# EAGLE design TPA6120_Test_V1 (EAGLE 6.4)
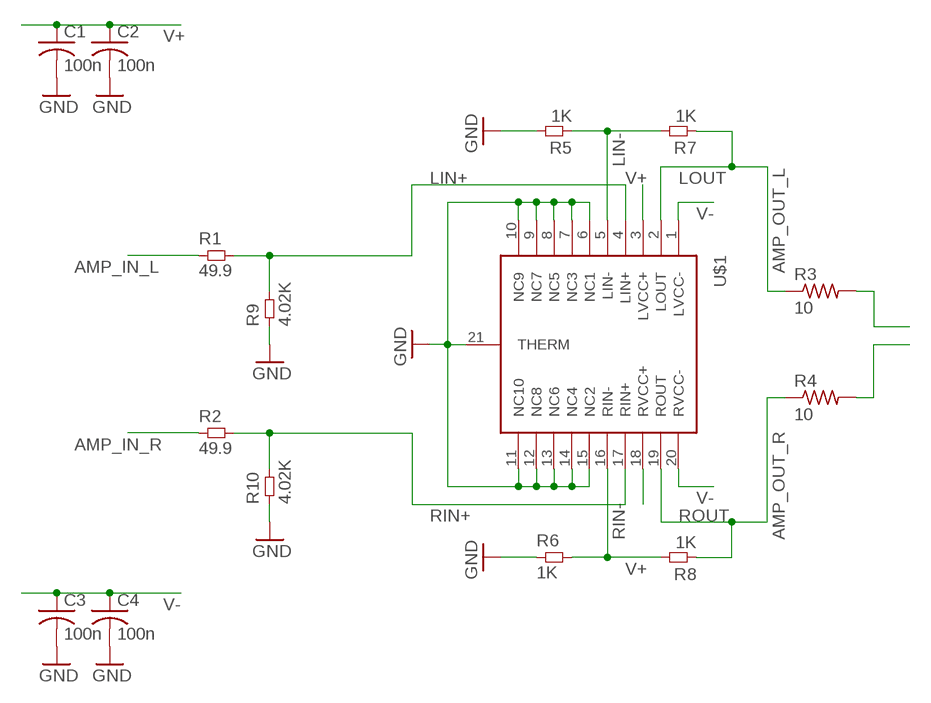
[diagram p0: schematic, sheet 1]

## Parts
C1  100n  C-USC0603  [C0603]
C2  100n  C-USC0603  [C0603]
C3  100n  C-USC0603  [C0603]
C4  100n  C-USC0603  [C0603]
R1  49.9  RES0603L3  [0603L3]
R2  49.9  RES0603L3  [0603L3]
R3  10  R-US_R1206  [R1206]
R4  10  R-US_R1206  [R1206]
R5  1K  RES0603L3  [0603L3]
R6  1K  RES0603L3  [0603L3]
R7  1K  RES0603L3  [0603L3]
R8  1K  RES0603L3  [0603L3]
R9  4.02K  RES0603L3  [0603L3]
R10  4.02K  RES0603L3  [0603L3]
U$1  TPA6120_TPA6120  [TPA6120_TPA6120]

## Nets
AMP_IN_L: R1.P$1
AMP_IN_R: R2.P$1
AMP_OUT_L: R3.2
AMP_OUT_R: R4.2
GND: C1.2 C2.2 C3.2 C4.2 R5.P$2 R6.P$1 R9.P$1 R10.P$1 U$1.6(NC1) U$1.7(NC3) U$1.8(NC5) U$1.9(NC7) U$1.10(NC9) U$1.11(NC10) U$1.12(NC8) U$1.13(NC6) U$1.14(NC4) U$1.15(NC2) U$1.21(THERM)
LIN+: R1.P$2 R9.P$2 U$1.4(LIN+)
LIN-: R5.P$1 R7.P$2 U$1.5(LIN-)
LOUT: R3.1 R7.P$1 U$1.2(LOUT)
RIN+: R2.P$2 R10.P$2 U$1.17(RIN+)
RIN-: R6.P$2 R8.P$2 U$1.16(RIN-)
ROUT: R4.1 R8.P$1 U$1.19(ROUT)
V+: C1.1 C2.1 U$1.3(LVCC+) U$1.18(RVCC+)
V-: C3.1 C4.1 U$1.1(LVCC-) U$1.20(RVCC-)

## Library data of the parts
C1-C4 = rcl:C-US: CAPACITOR, American symbol
R1 R2 R5-R10 = common:RES
R3 R4 = rcl:R-US_: RESISTOR, American symbol
U$1 = amp:TPA6120_TPA6120

## Board
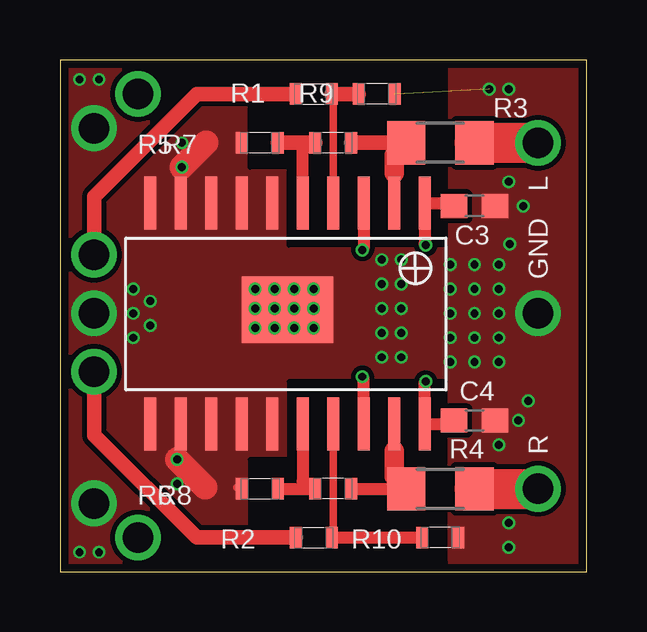
[diagram p1: board, top side]
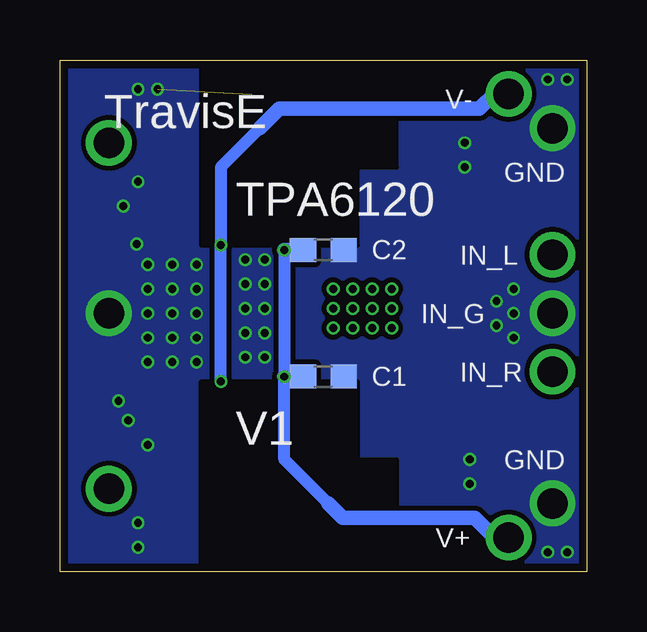
[diagram p2: board, bottom side, seen from below]

Size 21.95 x 21.34 mm. Coordinates in mm from the lower left corner, seen from the top.
Outline: 0,0 21.95,0 21.95,21.34 0,21.34 0,0
Copper layers (1*16): Top 0.035mm / dielectric 1.5mm / Bottom 0.035mm
Design rules "default *": minimum track width 10mil, minimum drill 24mil, track to track 8mil, track to pad 8mil, pad to pad 8mil, via to via 8mil, smd to smd 8mil, copper to edge 13mil, drill to drill 8mil, minimum pad ring 5mil, minimum via ring 4mil, stop-mask expansion 4mil, vias tented up to drill 14mil, thermal gap 10mil
tRestrict: area 7.9,0.4 to 16.1,7.9; area 7.9,13.6 to 16.1,20.9
bRestrict: area 7.9,0.4 to 16.1,7.9; area 7.9,13.6 to 16.1,20.9

### Footprints (pad centres in the part's own frame; a part is rotated, then mirrored left to right if it is on the bottom)
C0603 = smd 1.1 x 1: 1 -0.85,0; 2 0.85,0
0603L3 = smd 0.5 x 0.9: P$1 -0.75,0; P$2 0.75,0
R1206 = smd 1.6 x 1.803: 1 -1.422,0; 2 1.422,0
TPA6120_TPA6120 = smd 0.5 x 2.2: 1 0.25,1.095; 2 1.52,1.095; 3 2.79,1.095; 4 4.06,1.095; 5 5.33,1.095; 6 6.6,1.095; 7 7.87,1.095; 8 9.14,1.095; 9 10.41,1.095; 10 11.68,1.095; 11 11.68,10.295; 12 10.41,10.295; 13 9.14,10.295; 14 7.87,10.295; 15 6.6,10.295; 16 5.33,10.295; 17 4.06,10.295; 18 2.79,10.295; 19 1.52,10.295; 20 0.25,10.295 | smd 3.81 x 2.79: 21 5.965,5.54

### Placement (x,y rotation side)
C1  10.97,8.13 0 bottom
C2  10.97,13.41 0 bottom
C3  17.27,15.24 0 top
C4  17.27,6.3 0 top
R1  10.57,19.91 0 top
R2  10.57,1.42 0 top
R3  15.85,17.88 0 top
R4  15.85,3.45 0 top
R5  8.33,17.88 180 top
R6  8.33,3.45 0 top
R7  11.38,17.88 180 top
R8  11.38,3.45 180 top
R9  13.21,19.91 180 top
R10  15.85,1.42 180 top
U$1  15.44,16.46 180 top

### Tracks (layer width: path | path; a pad name or v marks a point on that pad's centre or on a via)
AMP_IN_L  (via drill 1.27)
  Top 0.61: v1.42,13.21 1.42,15.65 5.69,19.91 R1.P$1
AMP_IN_R  (via drill 1.27)
  Top 0.61: v1.42,8.33 1.42,5.69 5.69,1.42 R2.P$1
AMP_OUT_L  (via drill 1.27)
  Top 1.676: R3.2 v19.91,17.88
AMP_OUT_R  (via drill 1.27)
  Top 1.676: R4.2 v19.91,3.45
GND  (via drill 0.33, 1.27)  (1 unrouted)
  Top 0.305: 7.42,3.45 7.37,3.51
  Top 1.016: 6.04,3.51 v4.88,4.67 | 6.1,17.88 v5.08,16.87
  other vias: 1.42,10.77 0.81,20.52 1.63,20.52 0.81,0.81 1.63,0.81 5.08,17.88 3.05,11.79 3.76,11.28 3.05,10.77 3.76,10.26 3.05,9.75 4.88,3.66 1.42,2.84 1.42,18.49 13.41,13 14.22,13 13.41,11.99 13.41,10.97 13.41,9.96 13.41,8.94 14.22,11.99 14.22,10.97 14.22,9.96 14.22,8.94 16.26,12.8 16.26,11.79 16.26,10.77 16.26,9.75 16.26,8.74 17.27,12.8 17.27,11.79 17.27,10.77 17.27,9.75 17.27,8.74 18.29,12.8 18.29,11.79 18.29,10.77 18.29,9.75 18.29,8.74 18.75,13.67 19.3,15.24 18.69,16.26 18.69,20.12 17.88,20.12 18.69,2.03 18.69,1.02 19.51,7.11 19.1,6.3 18.29,5.28 19.91,10.77
  pour Bottom (no thermals): 0.41,20.93 21.54,20.93 21.54,0.41 0.41,0.41
  pour Top (no thermals): 0.41,20.93 21.54,20.93 21.54,0.41 0.41,0.41
LIN+
  Top 0.305: U$1.4 11.38,19.85 R1.P$2
  Top 0.61: R1.P$2 R9.P$2
LIN-
  Top 0.508: U$1.5 10.11,17.57 R7.P$2
  Top 0.61: R5.P$1 R7.P$2
LOUT
  Top 0.483: U$1.2 13.92,16.61
  Top 0.61: R7.P$1 R3.1
  Top 0.813: 13.92,16.61 13.92,17.37 R3.1
N$1  (via drill 0.33)
  other vias: 8.13,11.79
N$2  (via drill 0.33)
  other vias: 8.13,10.97
N$7  (via drill 0.33)
  other vias: 8.13,10.16
N$8  (via drill 0.33)
  other vias: 8.94,11.79
N$9  (via drill 0.33)
  other vias: 8.94,10.97
N$10  (via drill 0.33)
  other vias: 8.94,10.16
N$11  (via drill 0.33)
  other vias: 9.75,11.79
N$12  (via drill 0.33)
  other vias: 9.75,10.97
N$13  (via drill 0.33)
  other vias: 9.75,10.16
N$14  (via drill 0.33)
  other vias: 10.57,11.79
N$15  (via drill 0.33)
  other vias: 10.57,10.97
N$16  (via drill 0.33)
  other vias: 10.57,10.16
RIN+
  Top 0.305: U$1.17 11.38,1.49 R2.P$2
  Top 0.508: R2.P$2 R10.P$2
RIN-
  Top 0.508: R6.P$2 R8.P$2 10.11,3.77 U$1.16
ROUT
  Top 0.483: U$1.19 13.92,5.03
  Top 0.508: R8.P$1 R4.1
  Top 0.813: 13.92,5.03 13.92,3.96 R4.1
V+  (via drill 0.33, 1.27)
  Top 0.508: U$1.3 12.65,13.47 v12.6,13.41 | U$1.18 12.65,8.07 v12.6,8.13
  Bottom 0.508: 10.77,2.84 12.6,4.67 v12.6,8.13 v12.6,13.41
  Bottom 0.61: C2.1 v12.6,13.41 | C1.1 v12.6,8.13 | v3.25,1.42 3.86,1.42 4.67,2.23 10.16,2.23 10.77,2.84
V-  (via drill 0.33, 1.27)
  Top 0.508: C4.1 16.29,6.16 U$1.20 15.19,7.88 v15.24,7.93 | C3.1 16.3,15.37 U$1.1 15.19,13.66 v15.24,13.61
  Bottom 0.508: 13.61,18.49 15.24,16.87 v15.24,13.61 v15.24,7.93
  Bottom 0.61: v3.25,19.91 3.86,19.91 4.47,19.3 12.8,19.3 13.61,18.49

### Text on the board
tPlace: L | GND | R
bPlace: V- | TravisE | GND | TPA6120 | IN_L | IN_G | IN_R | V1 | GND | V+